# EAGLE schematic 4digitSSD-MAX7219CNG (EAGLE 7.6.0)
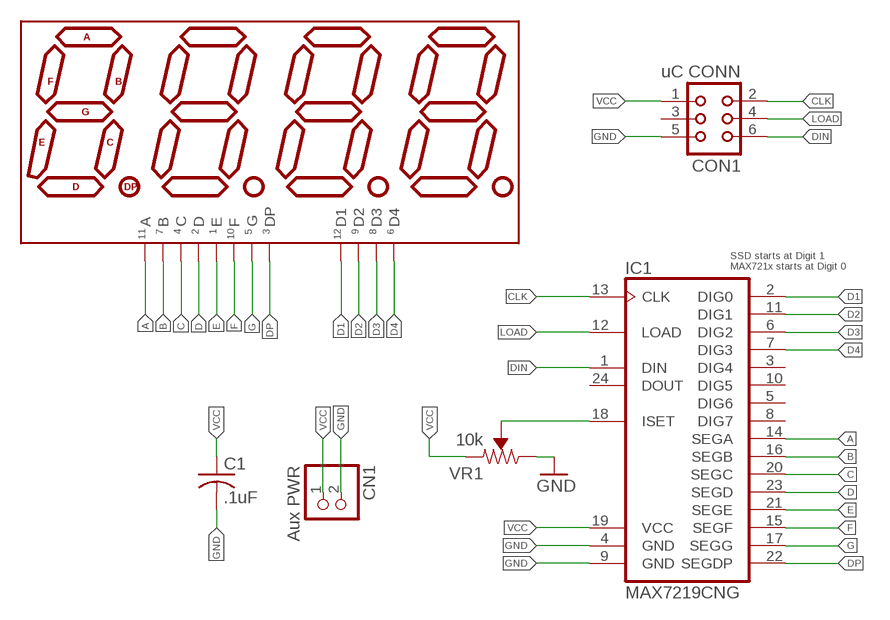
[diagram p0: schematic, sheet 1]

## Parts
C1  .1uF  C-USC1206  [C1206]
CN1  Aux PWR  JST_2PIN-THM  [JST-PH-2-THM]
CON1  uC CONN  CON06  [CON06]
IC1  MAX7219CNG  [DIL24-3]
U$1  7-SEGMENT-4DIGIT-COUNTERPTH  [7-SEGMENT-4DIGIT-COUNTER]
VR1  10k  TRIMPOT-PTH-10MM-KNOB-1/2W-10%  [TRIMPOT-PTH-3386U]

## Nets
A: IC1.14(SEGA) U$1.11(A)
B: IC1.16(SEGB) U$1.7(B)
C: IC1.20(SEGC) U$1.4(C)
CLK: CON1.2 IC1.13(CLK)
D: IC1.23(SEGD) U$1.2(D)
D1: IC1.2(DIG0) U$1.12(D1)
D2: IC1.11(DIG1) U$1.9(D2)
D3: IC1.6(DIG2) U$1.8(D3)
D4: IC1.7(DIG3) U$1.6(D4)
DIN: CON1.6 IC1.1(DIN)
DP: IC1.22(SEGDP) U$1.3(DP)
E: IC1.21(SEGE) U$1.1(E)
F: IC1.15(SEGF) U$1.10(F)
G: IC1.17(SEGG) U$1.5(G)
GND: C1.2 CN1.2 CON1.5 IC1.4(GND) IC1.9(GND) VR1.3(CW)
LOAD: CON1.4 IC1.12(LOAD)
N$1: IC1.18(ISET) VR1.2(WIPER)
VCC: C1.1 CN1.1 CON1.1 IC1.19(VCC) VR1.1(CCW)
Unconnected: CON1.3 IC1.3(DIG4) IC1.5(DIG6) IC1.8(DIG7) IC1.10(DIG5) IC1.24(DOUT)

## Notes on the sheet
- 7 | 4 | 2 | 1 | 5 | 3 | 9 | 8 | 6
- 11 | 10 | 12
- SSD starts at Digit 1
  MAX721x starts at Digit 0

## Library data of the parts
C1 = rcl:C-US: CAPACITOR, American symbol
CN1 = adafruit:JST_2PIN: JST 2-Pin Connectors of various flavors SMT-RA (S2B-PH-SM4) 4UConnector #17311 SMT (B2B-PH-SM4) THM-RA (S2B-PH) THM (B2B-PH)
CON1 = con-harting:CON06: CONNECTOR; OC_FARNELL: unknown; OC_NEWARK: unknown
IC1 = maxim:MAX7219CNG: LED DISPLAY DRIVER; MF: MAXIM; MPN: MAX7219CNG; OC_FARNELL: 1523914; OC_NEWARK: 34C4018
U$1 = SparkFun-Displays:7-SEGMENT-4DIGIT-COUNTER
VR1 = SparkFun-Resistors:TRIMPOT: Trimming Potentiometer (Trimpot) Three-terminal potentiometers, with an adjustable wiper and two adjustable resistors. A pot can be used to create a configurable voltage divider, or as a variable resistor. "Trimpots" are a subset of potentiometers, usually intended for "set-and-forget" applications. They're often more delicate than standard potentiometers - rated for fewer turns. Variants PTH-KNOB - PTH Trimpot w/ finger-adjustable knob Trimpot 10K with Knob <https://www.sparkfun.com/products/9806> (COM-09806) Datasheet <http://www.sparkfun.com/datasheets/Components/General/TSR-3386.pdf> SMD-3MM-CLOSED-FRAME - SMD 3mm Square Closed-Frame Trimpot Used on e.g. EasyDriver - Stepper Motor Driver <https://www.sparkfun.com/products/12779> Datasheet <http://www.bitechnologies.com/pdfs/22.pdf> (22AR10KTR) SMD-5MM - SMD 5mm Square Closed-Frame Trimpot Used on e.g. IOIO-OTG - V2.2 <https://www.sparkfun.com/products/13613> Datasheet <http://www.vishay.com/docs/51008/ts53.pdf> (TS53YL502MR10) SMD-3MM-1/10W-25% - 3mm Square Open-Frame Trimpot Used on e.g. SparkFun Shapeoko <https://www.sparkfun.com/products/13899> Datasheet <http://www.bourns.com/docs/Product-Datasheets/TC33.pdf> (TC33X-2-103E); PROD_ID: RES-09730; SF_SKU: COM-09806

## Net classes
0 default: width 0.254 mm, drill 0.508 mm, clearance 0.305 mm